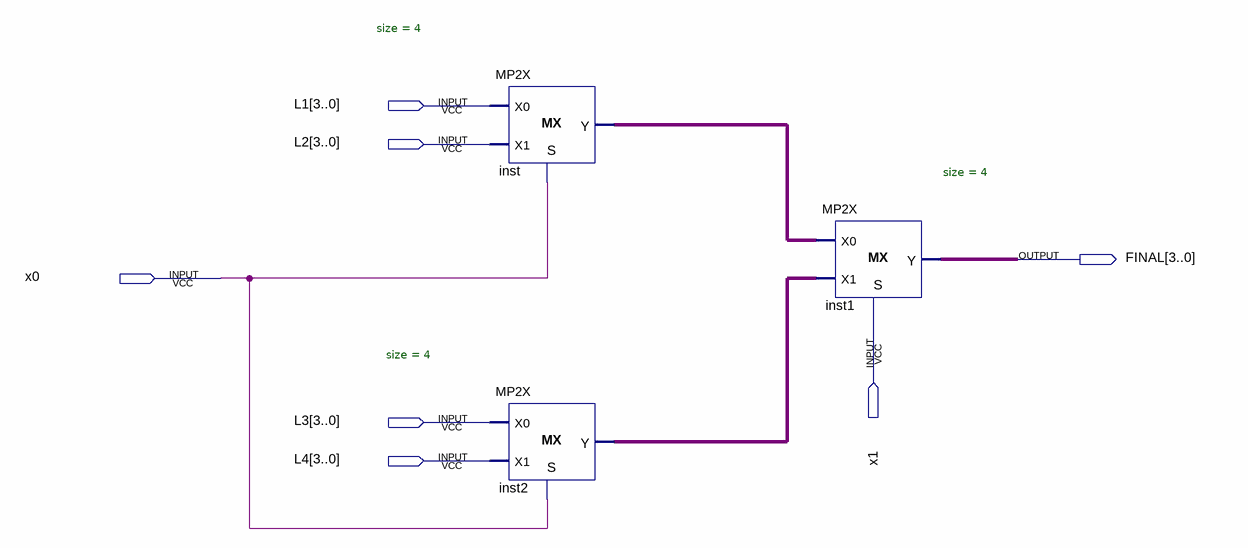
[diagram p0: schematic sheet]
// Quartus schematic MP4X.bdf as structural Verilog: 3 symbols, 7 pins
module MP4X (
  input  [3:0] L1,
  input  [3:0] L2,
  input  x0,
  input  x1,
  input  [3:0] L3,
  input  [3:0] L4,
  output [3:0] FINAL
);

  wire [3:0] inst2_y, inst_y;

  MP2X #(.size(4)) inst (.S(x0), .X0(L1), .X1(L2), .Y(inst_y));
  MP2X #(.size(4)) inst2 (.S(x0), .X0(L3), .X1(L4), .Y(inst2_y));
  MP2X #(.size(4)) inst1 (.S(x1), .X0(inst_y), .X1(inst2_y), .Y(FINAL));
endmodule
